# EAGLE design Display (EAGLE 9.2.2)
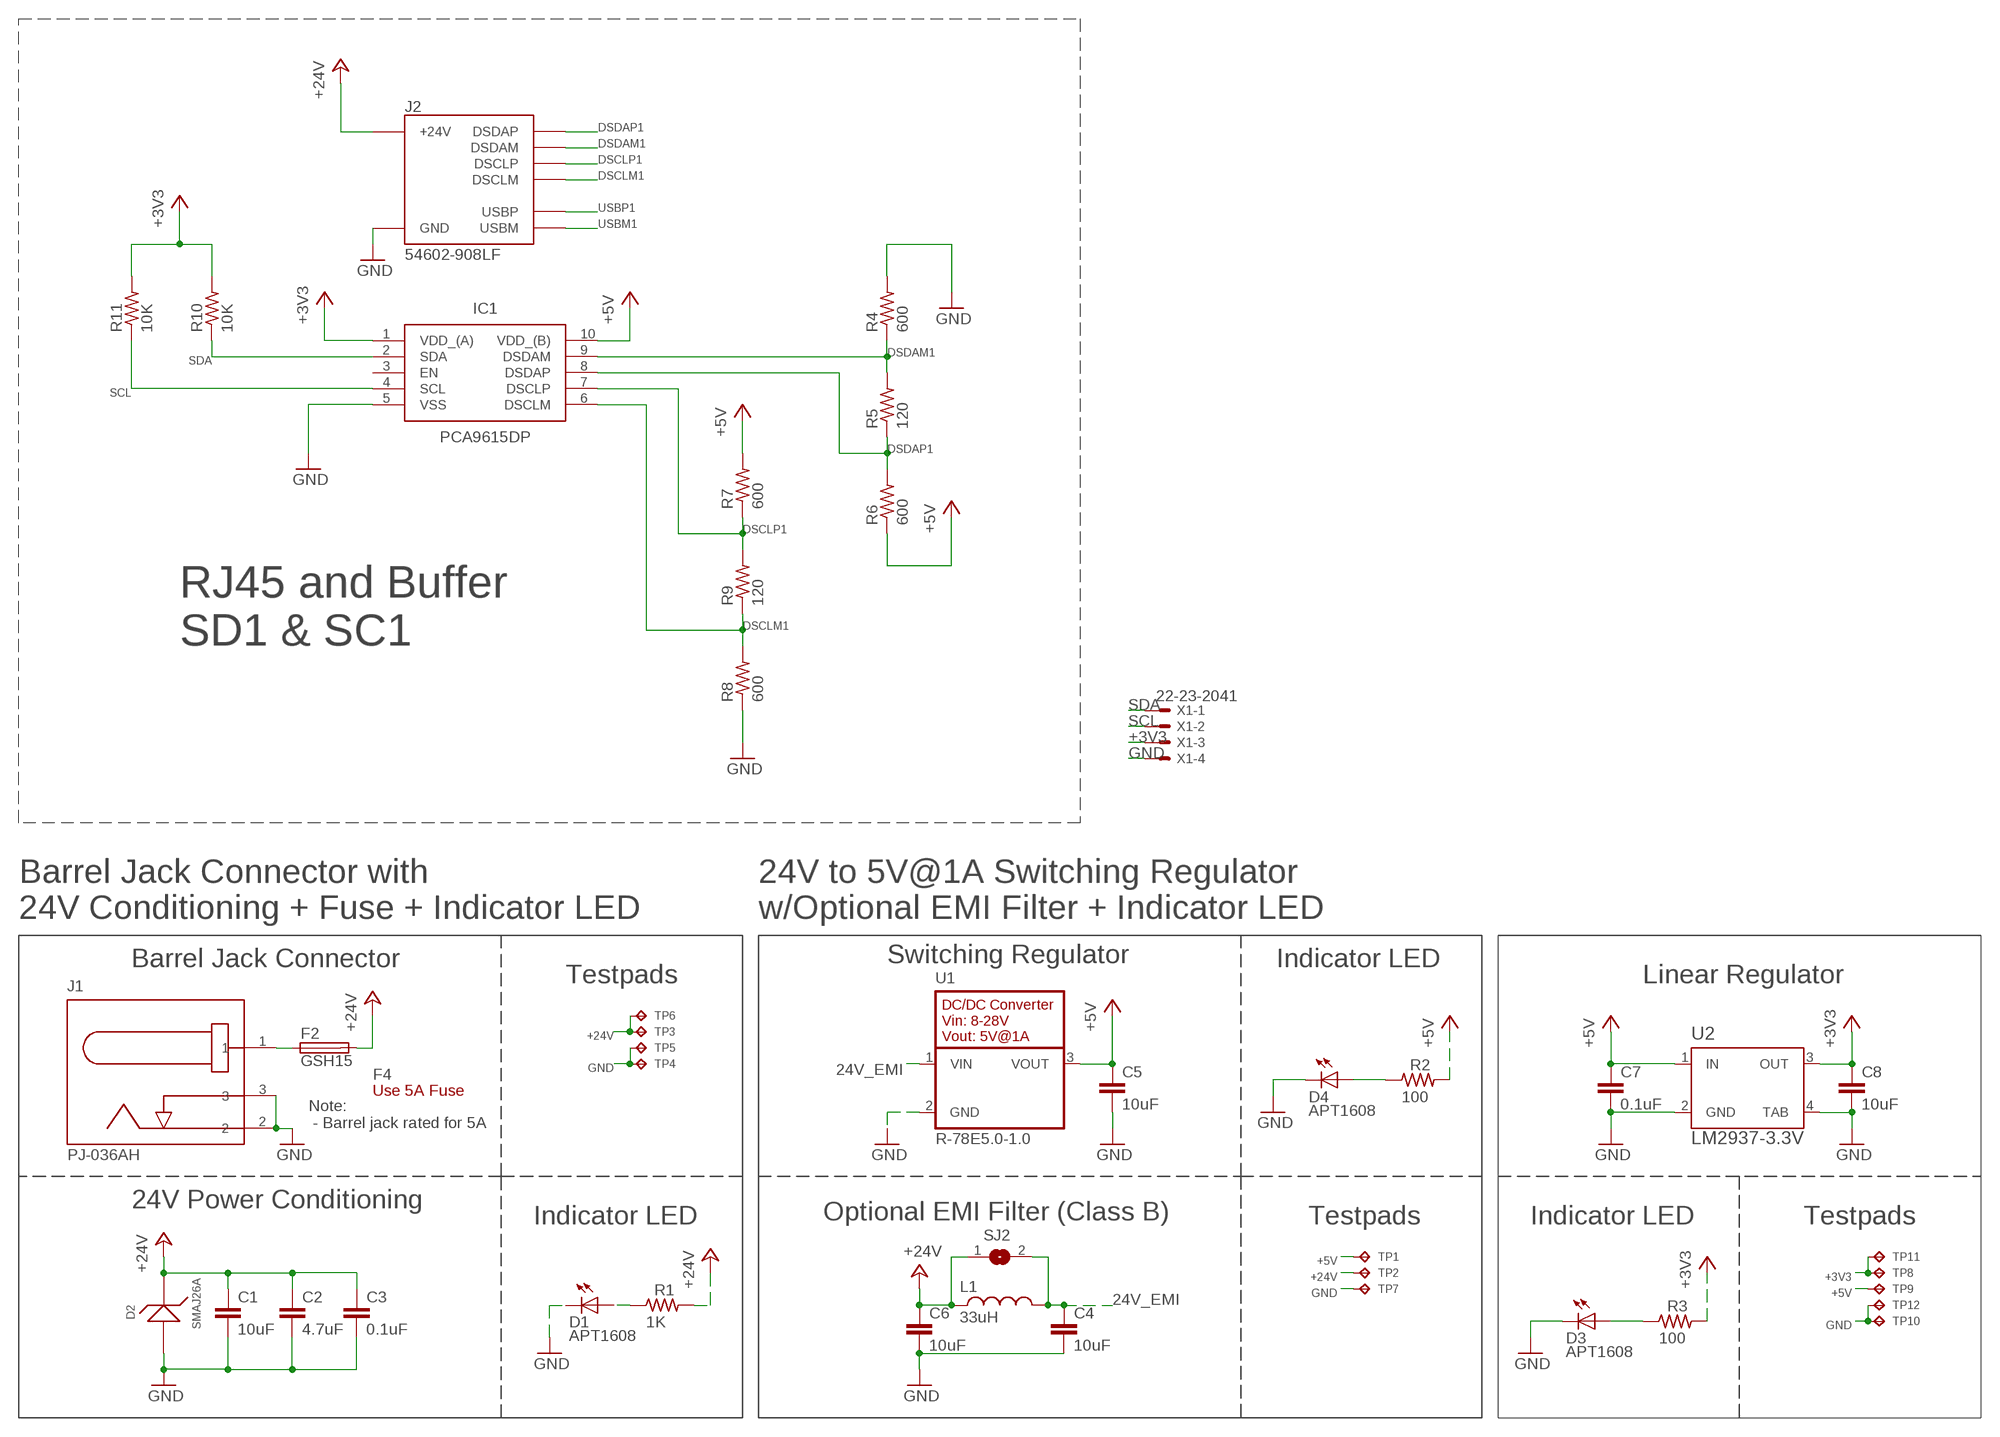
[diagram p0: schematic, sheet 1]

## Parts
C1  10uF  10UF-GMK212BBJ106KG-T  [C0805]
C2  4.7uF  4.7UF-CL21A475KBQNNNE  [C0805]
C3  0.1uF  0.1UF-C0603C104K5RACTU  [C0603]
C4  10uF  10UF-GMK212BBJ106KG-T  [C0805]
C5  10uF  10UF-GMK212BBJ106KG-T  [C0805]
C6  10uF  10UF-GMK212BBJ106KG-T  [C0805]
C7  0.1uF  0.1UF-C0603C104K5RACTU  [C0603]
C8  10uF  10UF-GMK212BBJ106KG-T  [C0805]
D1  APT1608  APT1608CGCK  [CHIPLED_0603]
D2  SMAJ26A  SMAJ26A-13-F  [SMA]
D3  APT1608  APT1608CGCK  [CHIPLED_0603]
D4  APT1608  APT1608CGCK  [CHIPLED_0603]
F2  GSH15  [GSH15]
F4  Use 5A Fuse  0217005.MXP  [FUSE-CARTRIDGE]
IC1  PCA9615DP  [SOP50P490X110-10N]
J1  PJ-036AH  BARREL-JACK-PJ-036AH-SMT-TR  [BARREL-JACK-PJ-036AH]
J2  54602-908LF  OPENAG-V1-RJ45PTH  [OPENAG-V1-RJ45]
L1  33uH  33UH-29333C  [29333C]
R1  1K  1K-ERJ-PB3D1001V  [RC0603N]
R2  100  100OHM-RC0603JR-07100RL  [RC0603N]
R3  100  100OHM-RC0603JR-07100RL  [RC0603N]
R4  600  R-US_R0603  [R0603]
R5  120  R-US_R0603  [R0603]
R6  600  R-US_R0603  [R0603]
R7  600  R-US_R0603  [R0603]
R8  600  R-US_R0603  [R0603]
R9  120  R-US_R0603  [R0603]
R10  10K  R-US_R0603  [R0603]
R11  10K  R-US_R0603  [R0603]
SJ2  EMI-BYPASS  [EMI-BYPASS]
TP1  TPTP06R  [TP06R]
TP2  TPTP06R  [TP06R]
TP3  TPTP04R  [TP04R]
TP4  TPTP04R  [TP04R]
TP5  TPTP04R  [TP04R]
TP6  TPTP04R  [TP04R]
TP7  TPTP06R  [TP06R]
TP8  TPTP04R  [TP04R]
TP9  TPTP04R  [TP04R]
TP10  TPTP04R  [TP04R]
TP11  TPTP04R  [TP04R]
TP12  TPTP04R  [TP04R]
U1  R-78E5.0-1.0  [R-78E5.0-1.0]
U2  LM2937-3.3V  LM2937IMP-3.3/NOPB  [MP04A]
X1  22-23-2041  [22-23-2041]

## Nets
24V_EMI: C4.1 L1.2 SJ2.2 U1.1(VIN)
24V_IN1: F2.1 J1.1
+3V3: C8.1 IC1.1(VDD_(A)) R3.2 R10.2 R11.2 TP8.1(TP) TP11.1(TP) U2.3(OUT) X1.3
+5V: C5.1 C7.1 IC1.10(VDD_(B)) R2.2 R6.1 R7.2 TP1.TP TP9.1(TP) U1.3(VOUT) U2.1(IN)
+24V: C1.1 C2.1 C3.1 C6.1 D2.1 F2.2 J2.24V(6)(+24V) L1.1 R1.2 SJ2.1 TP2.TP TP3.1(TP) TP6.1(TP)
DSCLM1: IC1.6(DSCLM) J2.DSCLM(5)(DSCLM) R8.2 R9.1
DSCLP1: IC1.7(DSCLP) J2.DSCLP(4)(DSCLP) R7.1 R9.2
DSDAM1: IC1.9(DSDAM) J2.DSDAM(2)(DSDAM) R4.1 R5.2
DSDAP1: IC1.8(DSDAP) J2.DSDAP(1)(DSDAP) R5.1 R6.2
GND: C1.2 C2.2 C3.2 C4.2 C5.2 C6.2 C7.2 C8.2 D1.C D2.2 D3.C D4.C IC1.5(VSS) J1.2 J1.3 J2.GND(3)(GND) R4.2 R8.1 TP4.1(TP) TP5.1(TP) TP7.TP TP10.1(TP) TP12.1(TP) U1.2(GND) U2.2(GND) U2.4(TAB) X1.4
N$1: D1.A R1.1
N$3: D4.A R2.1
N$4: D3.A R3.1
SCL: IC1.4(SCL) R11.1 X1.2
SDA: IC1.2(SDA) R10.1 X1.1
USBM1: J2.USBM(8)(USBM)
USBP1: J2.USBP(7)(USBP)
Unconnected: IC1.3(EN)

## Notes on the sheet
- RJ45 and Buffer
  SD1 & SC1
- Barrel Jack Connector with
  24V Conditioning + Fuse + Indicator LED
- 24V to 5V@1A Switching Regulator
  w/Optional EMI Filter + Indicator LED
- Barrel Jack Connector | Switching Regulator | Indicator LED
- Testpads | Linear Regulator
- Note:
   - Barrel jack rated for 5A
- 24V Power Conditioning
- Indicator LED | Optional EMI Filter (Class B) | Testpads | Indicator LED | Testpads

## Library data of the parts
C1 C4-C6 C8 = openag-capacitors:10UF-GMK212BBJ106KG-T: CAP CER 10UF 35V X5R 0805 Description: 10µF ±10% 35V Ceramic Capacitor X5R 0805 (2012 Metric) Technical Specifications: Capacitance: 10µF Tolerance: ±10% Rated Voltage: 35V Temperature Coefficient: X5R Operating Temperature: -55°C ~ 85°C Package / Case: 0805 (2012 Metric) Datasheet(s): GMK212BBJ106KG-T Spec <http://ds.yuden.co.jp/TYCOMPAS/ut/detail.do?productNo=GMK212BBJ106KG-T&fileName=GMK212BBJ106KG-T_SS&mode=specSheetDownload> Vendor(s): Digikey: 587-4893-1-ND <https://www.digikey.com/product-detail/en/taiyo-yuden/GMK212BBJ106KG-T/587-4893-1-ND/6563736>; MANUFACTURER: Taiyo Yuden; MPN: GMK212BBJ106KG-T; VENDOR: Digikey; VLINK: https://www.digikey.com/product-detail/en/taiyo-yuden/GMK212BBJ106KG-T/587-4893-1-ND/6563736; VPN: 587-4893-1-ND
C2 = openag-capacitors:4.7UF-CL21A475KBQNNNE: CAP CER 4.7UF 50V X5R 0805 Description: 4.7µF ±10% 50V Ceramic Capacitor X5R 0805 (2012 Metric) Technical Specifications: Capacitance: 4.7uF Tolerance: ±10% Rated Voltage: 50V Temperature Coefficient: X5R Operating Temperature: -55°C ~ 85°C Package/Case: 0805 (2012 Metric) Datasheet(s): CL21A475KBQNNNE Characteristics <http://www.samsungsem.com/kr/front/downloadcms.do?path=/kr/support/product-search/mlcc/__icsFiles/afieldfile/2014/11/05&fileName=C_CL21A475KBQNNNE.pdf> Vendor(s): Digikey: 1276-1248-1-ND <https://www.digikey.com/product-detail/en/samsung-electro-mechanics/CL21A475KBQNNNE/1276-1248-1-ND/3889334>; MANUFACTURER: Samsung; MPN: CL21A475KBQNNNE; VENDOR: Digikey; VLINK: https://www.digikey.com/product-detail/en/samsung-electro-mechanics/CL21A475KBQNNNE/1276-1248-1-ND/3889334; VPN: 1276-1248-1-ND
C3 C7 = openag-capacitors:0.1UF-C0603C104K5RACTU: CAP CER 0.1UF 50V X7R 0603 Description: 0.1µF ±10% 50V Ceramic Capacitor X7R 0603 (1608 Metric) Technical Specifications: Capacitance: 0.1µF Tolerance: ±10% Rated Voltage: 50V Temperature Coefficient: X7R Operating Temperature: -55°C ~ 125°C Package / Case: 0603 (1608 Metric) Datasheet(s): X7R Dielectric, 6.3-250 VDC <https://search.kemet.com/component-edge/download/datasheet/C0603C104K5RACTU.pdf> Vendor(s): Digikey: 399-5089-1-ND <https://www.digikey.com/product-detail/en/kemet/C0603C104K5RACTU/399-5089-1-ND/1465623>; MANUFACTURER: Kemet; MPN: C0603C104K5RACTU; VENDOR: Digikey; VLINK: https://www.digikey.com/product-detail/en/kemet/C0603C104K5RACTU/399-5089-1-ND/1465623; VPN: 399-5089-1-ND
D1 D3 D4 = openag-diodes:APT1608CGCK: LED GREEN CLEAR 0603 SMD Description: Green 570nm LED Indication - Discrete 2.1V 0603 (1608 Metric) Technical Specifications: Color: Green Lens Color: Colorless Lens Transparency: Clear Millicandela Rating: 50mcd Lens Style/Size: Rectangle with Flat Top, 1.20mm x 0.80mm Voltage - Forward (Vf) (Typ): 2.1V Current - Test: 20mA Viewing Angle: 120° Mounting Type: Surface Mount Wavelength - Dominant: 570nm Wavelength - Peak: 574nm Package / Case: 0603 (1608 Metric) Supplier Device Package: Chip LED Size / Dimension: 1.60mm L x 0.80mm W Height (Max): 0.75mm Datasheet(s): APT1608CGCK <http://www.kingbrightusa.com/images/catalog/SPEC/APT1608CGCK.pdf> Vendor(s): Digikey: 754-1116-1-ND <https://www.digikey.com/product-detail/en/kingbright/APT1608CGCK/754-1116-1-ND/1747833#>; MANUFACTURER: Kingbright; MPN: APT1608CGCK; VENDOR: Digikey; VLINK: https://www.digikey.com/product-detail/en/kingbright/APT1608CGCK/754-1116-1-ND/1747833#; VPN: 754-1116-1-ND
D2 = openag-diodes:SMAJ26A-13-F: TVS DIODE 26VWM 42.1VC SMA Description: TVS DIODE 26VWM 42.1VC SMA Technical Specifications: Type: Zener Voltage - Reverse Standoff (Typ): 26V Voltage - Breakdown (Min): 28.9V Voltage - Clamping (Max) @ Ipp: 42.1V Current - Peak Pulse (10/1000µs): 9.5A Power - Peak Pulse: 400W Power Line Protection: No Operating Temperature: -55°C ~ 150°C (TJ) DO-214AC, SMA Datasheet(s): SMAJ5.0(C)A - SMAJ200(C)A Vendor(s): Digikey: SMAJ26A-FDICT-ND <https://www.digikey.com/product-detail/en/diodes-incorporated/SMAJ26A-13-F/SMAJ26A-FDICT-ND/806583>; MANUFACTURER: Diodes Incorporated; MPN: SMAJ26A-13-F; VENDOR: Digikey; VLINK: https://www.digikey.com/product-detail/en/diodes-incorporated/SMAJ26A-13-F/SMAJ26A-FDICT-ND/806583; VPN: SMAJ26A-FDICT-ND
F2 = openag-fuses:GSH15: FUSE BLOCK CART 250V 6.3A PCB Description: Fuse Block 6.3A 250V 1 Circuit Cartridge PCB Technical Specifications: Fuseholder Type: Block Fuse Type: Cartridge For Use With/Related Products: 5mm x 20mm Fuse Size: 5mm x 20mm Number of Circuits: 1 Voltage: 250V Current Rating: 6.3A Mounting Type: PCB Orientation: Horizontal Termination Style: PC Pin Contact Material: Copper Alloy Contact Finish: Tin Datasheet(s): 649 Series <http://www.littelfuse.com/~/media/electronics/datasheets/fuse_blocks/littelfuse_fuse_block_649_datasheet.pdf.pdf> Vendor(s): Digikey: WK0011-ND <https://www.digikey.com/product-detail/en/littelfuse-inc/64900001039/WK0011-ND/245470>; MANUFACTURER: Littelfuse Inc.; MPN: 64900001039; VENDOR: Digikey; VLINK: https://www.digikey.com/product-detail/en/littelfuse-inc/64900001039/WK0011-ND/245470; VPN: WK0011-ND
F4 = openag-fuses:0217005.MXP: FUSE GLASS 5A 250VAC 5X20MM Description: FUSE GLASS 5A 250VAC 5X20MM Technical Specifications: Fuse Type: Cartridge, Glass Current Rating: 5A Voltage Rating - AC: 250V Response Time: Fast Package / Case: 5mm x 20mm Mounting Type: Holder Breaking Capacity @ Rated Voltage: 50A Melting I²t: 42.795 Approvals: BSI, CE, CCC, CSA, KC, PSE, SEMKO, UR, VDE Operating Temperature: -55°C ~ 125°C Size / Dimension: 0.205" Dia x 0.787" L (5.20mm x 20.00mm) DC Cold Resistance: 0.0137 Ohms Datasheet(s): 217 Series Datasheet <http://www.littelfuse.com/~/media/electronics/datasheets/fuses/littelfuse_fuse_217_datasheet.pdf.pdf> Vendor(s): Digikey: F1725-ND <https://www.digikey.com/product-detail/en/littelfuse-inc/0217005.MXP/F1725-ND/777549#>; MANUFACTURER: Littelfuse Inc.; MPN: 0217005.MXP; VENDOR: Digikey; VLINK: https://www.digikey.com/product-detail/en/littelfuse-inc/0217005.MXP/F1725-ND/777549; VPN: F1725-ND
IC1 = PCA9615DP:PCA9615DP: Buffer, ReDriver 2 Channel 400kHz 10-TSSOP Source: Datasheet <http://www.nxp.com/docs/en/data-sheet/PCA9615.pdf>; DESCRIPTION: Buffer, ReDriver 2 Channel 400kHz 10-TSSOP; HEIGHT: 1.1mm; MANUFACTURER_NAME: Nexperia; MANUFACTURER_PART_NUMBER: PCA9615DP; SUPPLIER_NAME: RS
J1 = openag-connectors:BARREL-JACK-PJ-036AH-SMT-TR: CONN PWR JACK 2X5.5MM SOLDER Description: Power Barrel Connector Jack 2.10mm ID (0.083"), 5.50mm OD (0.217") Surface Mount, Right Angle Technical Specifications: Connector Type: Jack Gender: Male Industry Recognized Mating Diameter: 2.10mm ID (0.083"), 5.50mm OD (0.217") Actual Diameter: 0.078" (2.00mm ID), 0.248" (6.30mm OD) Number of Positions/Contacts: 2 Conductors, 3 Contacts Internal Switch(s): Single Switch, Normally Closed Mounting Type: Surface Mount, Right Angle Termination: Solder Shielding: Unshielded Voltage - Rated: 24VDC Current Rating: 5A Mating Length/Depth: 0.360" (9.15mm) Contact Material - Plating: Silver Operating Temperature: -25°C ~ 85°C Housing Material: Polyamide (PA6T), Nylon 6T Contact Material: Brass; Copper Alloy Body Color: Black Datasheet(s): PJ-036AH-SMT-TR <http://www.cui.com/product/resource/digikeypdf/pj-036ah-smt-tr.pdf> Vendor(s): Digikey: CP-036AHPJCT-ND <https://www.digikey.com/product-detail/en/cui-inc/PJ-036AH-SMT-TR/CP-036AHPJCT-ND/1530994>; MANUFACTURER: CUI Inc.; MPN: PJ-036AH-SMT-TR; VENDOR: Digikey; VLINK: https://www.digikey.com/product-detail/en/cui-inc/PJ-036AH-SMT-TR/CP-036AHPJCT-ND/1530994; VPN: CP-036AHPJCT-ND
J2 = openag_connector:OPENAG-V1-RJ45: Amphenol FCI - 54602-908LF - CONN MOD JACK 8P8C R/A UNSHLD Description: Jack Modular Connector 8p8c (RJ45, Ethernet) 90� Angle (Right) Unshielded Cat3 Technical Specifications: Connector Type: Jack Number of Positions/Contacts: 8p8c (RJ45, Ethernet) Number of Ports: 1 Number of Rows: 1 Mounting Type: Through Hole Orientation: 90� Angle (Right) Termination: Solder Shielding: Unshielded Ratings: Cat3 Features: Board Lock LED Color: Does Not Contain LED Tab Direction: Down Contact Material: Copper Alloy Contact Finish: Gold Contact Finish Thickness: 15�in (0.38�m) Housing Material: Polyester, Glass Filled Operating Temperature: -40�C ~ 70�C Datasheet(s): 54601-x04(zzz)WPLF Drawing <http://cdn.amphenol-icc.com/media/wysiwyg/files/drawing/c-bmj-0102.pdf> Vendor(s): Digikey: 609-1046-ND <https://www.digikey.com/product-detail/en/amphenol-fci/54602-908LF/609-1046-ND/1001360>; POPULATE: YES; VERIFIED: NO
L1 = openag-inductors:33UH-29333C: FIXED IND 33UH 1A 120 MOHM SMD Description: 33µH Shielded Wirewound Inductor 1A 120 mOhm Max Nonstandard Technical Specifications: Type: Wirewound Inductance: 33µH Current Rating: 1A Shielding: Shielded DC Resistance (DCR): 120 mOhm Max Operating Temperature: -40°C ~ 85°C Frequency - Test: 10kHz Mounting Type: Surface Mount Package / Case: Nonstandard Size / Dimension: 0.283" L x 0.283" W (7.20mm x 7.20mm) Height - Seated (Max): 0.157" (4.00mm) Datasheet(s): 2900 Series <https://www.murata-ps.com/data/magnetics/kmp_2900.pdf> Vendor(s): Digikey: 811-1138-1-ND <https://www.digikey.com/product-detail/en/murata-power-solutions-inc/29333C/811-1138-1-ND/1924860>; MANUFACTURER: Murata Power Solutions Inc.; MPN: 29333C; VENDOR: Digikey; VLINK: https://www.digikey.com/product-detail/en/murata-power-solutions-inc/29333C/811-1138-1-ND/1924860; VPN: 811-1138-1-ND
R1 = openag-resistors:1K-ERJ-PB3D1001V: RES SMD 1K OHM 0.5% 1/5W 0603 Description: 1 kOhms ±0.5% 0.2W, 1/5W Chip Resistor 0603 (1608 Metric) Automotive AEC-Q200, Pulse Withstanding Thick Film Technical Specifications: Resistance: 1 kOhms Tolerance: ±0.5% Power: 0.2W, 1/5W Operating Temperature: -55°C ~ 155°C Package / Case: 0603 (1608 Metric) Datasheet(s): ERJ-PB3, PB6 Series, High Precision Datasheet <https://industrial.panasonic.com/cdbs/www-data/pdf/RDM0000/AOA0000C328.pdf> Vendor(s): Digikey: P20283CT-ND <https://www.digikey.com/product-detail/en/panasonic-electronic-components/ERJ-PB3D1001V/P20283CT-ND/6214538>; MANUFACTURER: Panasonic; MPN: P20283CT-ND; VENDOR: Digikey; VLINK: https://www.digikey.com/product-detail/en/panasonic-electronic-components/ERJ-PB3D1001V/P20283CT-ND/6214538; VPN: P20283CT-ND
R2 R3 = openag-resistors:100OHM-RC0603JR-07100RL: RES SMD 100 OHM 5% 1/10W 0603 Description: 100 Ohms ±5% 0.1W, 1/10W Chip Resistor 0603 (1608 Metric) Moisture Resistant Thick Film Technical Specifications: Resistance: 100 Ohms Tolerance: ±5% Power (Watts): 0.1W, 1/10W Composition: Thick Film Features: Moisture Resistant Temperature Coefficient: ±100ppm/°C Operating Temperature: -55°C ~ 155°C Package / Case: 0603 (1608 Metric) Supplier Device Package: 0603 Size / Dimension: 0.063" L x 0.032" W (1.60mm x 0.80mm) Height - Seated (Max): 0.022" (0.55mm) Number of Terminations: 2 Datasheet(s): Thick Film Chip Resistor Intro <http://www.yageo.com.tw/exep/pages/download/literatures/PYu-R_INT-thick_7.pdf> Chip Resistor Marking <http://www.yageo.com/exep/pages/download/literatures/PYu-R_Marking_2.pdf> RC Series, L Datasheet <http://www.yageo.com/documents/recent/PYu-RC_Group_51_RoHS_L_8.pdf> Vendor(s): Digikey: 311-100GRCT-ND <https://www.digikey.com/product-detail/en/yageo/RC0603JR-07100RL/311-100GRCT-ND/729644>; MANUFACTURER: Yageo; MPN: RC0603JR-07100RL; VENDOR: Digikey; VLINK: https://www.digikey.com/product-detail/en/yageo/RC0603JR-07100RL/311-100GRCT-ND/729644; VPN: 311-100GRCT-ND
R4-R11 = rcl:R-US_: RESISTOR, American symbol
SJ2 = openag-connectors:EMI-BYPASS: EMI Bypass Solder Jumper; MPN: N/A
TP1-TP12 = openag-testpads:TP: Test pad; MPN: N/A
U1 = openag-regulators:R-78E5.0-1.0: DC/DC CONVERTER 5V 5W Description: Linear Regulator Replacement DC DC Converter 1 Output 5V 1A 8V - 28V Input Technical Specifications: Type: Linear Regulator Replacement Number of Outputs: 1 Voltage - Input (Min): 8V Voltage - Input (Max): 28V Voltage - Output 1: 5V Current - Output (Max): 1A Power (Watts): 5W Applications: ITE (Commercial) Features: SCP Operating Temperature: -40°C ~ 85°C Efficiency: 91% Mounting Type: Through Hole Package / Case: 3-SIP Module Size / Dimension: 0.46" L x 0.33" W x 0.41" H (11.6mm x 8.5mm x 10.4mm) Datasheet(s): R-78E-1.0 Series Datasheet <https://www.recom-power.com/pdf/Innoline/R-78Exx-1.0.pdf> Vendor(s): Digikey: 945-2201-ND <https://www.digikey.com/product-detail/en/recom-power/R-78E5.0-1.0/945-2201-ND/4930585>; MANUFACTURER: Recom Power; MPN: R-78E5.0-1.0; VENDOR: Digikey; VLINK: https://www.digikey.com/product-detail/en/recom-power/R-78E5.0-1.0/945-2201-ND/4930585; VPN: 945-2201-ND
U2 = openag-regulators:LM2937IMP-3.3/NOPB: IC REG LIN 3.3V 400MA SOT223-4 Description: Linear Voltage Regulator IC Positive Fixed 1 Output 3.3V 400mA SOT-223-4 Technical Specifications: Output Configuration: Positive Output Type: Fixed Number of Regulators: 1 Voltage - Input (Max): 26V Voltage - Output (Min/Fixed): 3.3V Voltage Dropout (Max): 1V @ 50mA Current - Output: 400mA Current - Quiescent (Iq): 2mA Current - Supply (Max): 1.25A Protection Features: Over Temperature, Reverse Polarity, Short Circuit Operating Temperature: -40°C ~ 85°C Mounting Type: Surface Mount Package / Case: TO-261-4, TO-261AA Supplier Device Package: SOT-223-4 Base Part Number: LM2937 Datasheet(s): LM2937-2.5, LM2937-3.3 Datasheet <http://www.ti.com/lit/ds/symlink/lm2937-2.5.pdf> Vendor(s): Digikey: LM2937IMP-3.3/NOPBCT-ND <https://www.digikey.com/product-detail/en/texas-instruments/LM2937IMP-3.3-NOPB/LM2937IMP-3.3-NOPBCT-ND/270742#>; MANUFACTURER: Texas Instruments; MPN: LM2937IMP-3.3/NOPB; VENDOR: Digikey; VLINK: https://www.digikey.com/product-detail/en/texas-instruments/LM2937IMP-3.3-NOPB/LM2937IMP-3.3-NOPBCT-ND/270742#; VPN: LM2937IMP-3.3/NOPBCT-ND
X1 = con-molex:22-23-2041: .100" (2.54mm) Center Header - 4 Pin; MF: MOLEX; MPN: 22-23-2041; OC_FARNELL: 1462920; OC_NEWARK: 38C0355

## Board
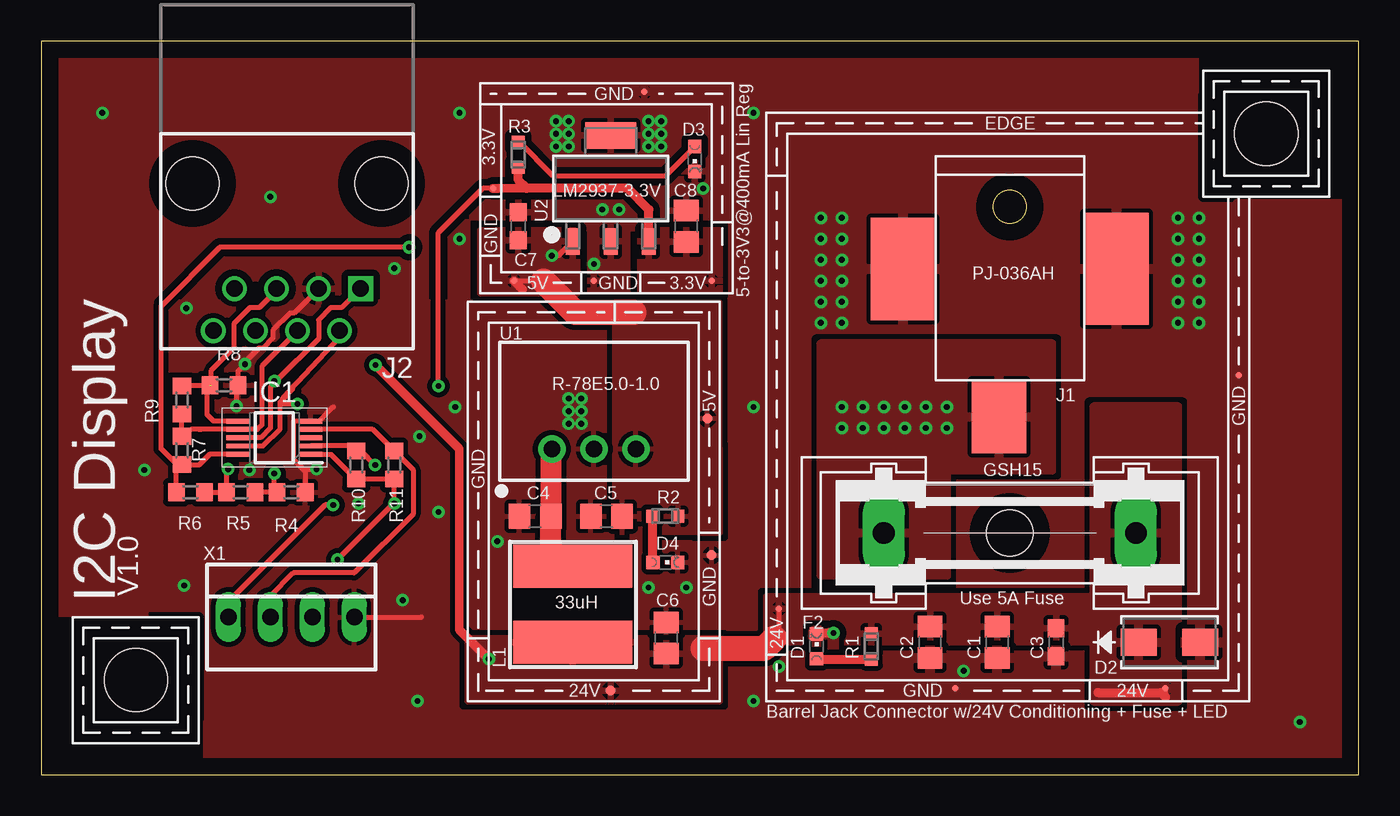
[diagram p1: board, top side]
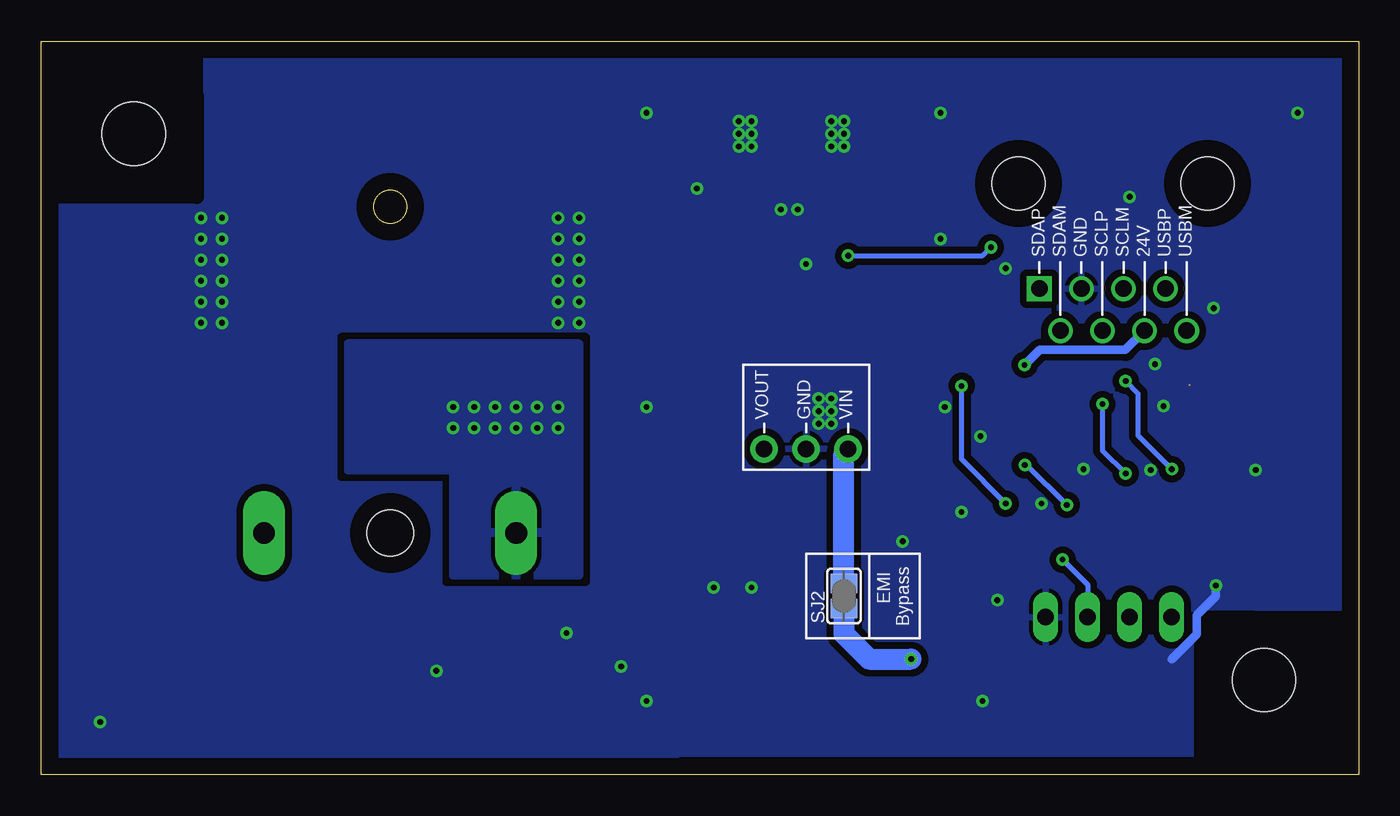
[diagram p2: board, bottom side, seen from below]

Size 79.63 x 44.32 mm. Coordinates in mm from the lower left corner, seen from the top.
Outline: 0,0 79.63,0 79.63,44.32 0,44.32 0,0
Copper layers (1*16): Top 0.035mm / dielectric 1.5mm / Bottom 0.035mm
Design rules "default": minimum track width 6mil, minimum drill 0.35mm, track to track 6mil, track to pad 6mil, pad to pad 6mil, via to via 6mil, smd to smd 6mil, copper to edge 40mil, drill to drill 6mil, minimum pad ring 10mil, minimum via ring 8mil, stop-mask expansion 4mil, vias tented up to drill 0mil, thermal gap 10mil
tRestrict: 2 lines

### Footprints (pad centres in the part's own frame; a part is rotated, then mirrored left to right if it is on the bottom)
C0805 = smd 1.3 x 1.5: 1 -0.95,0; 2 0.95,0
C0603 = smd 1.1 x 1: 1 -0.85,0; 2 0.85,0
CHIPLED_0603 = smd 0.8 x 0.8: A 0,-0.75; C 0,0.75
SMA = smd 2.18 x 1.63: 1 -1.857,0; 2 1.857,0
GSH15 = drill 1.321 pad 2.54 long: 1 -7.62,0; 2 7.62,0 | hole 2.794: 0,0
SOP50P490X110-10N = smd 1.4 x 0.3: 1 -2.2,1; 2 -2.2,0.5; 3 -2.2,0; 4 -2.2,-0.5; 5 -2.2,-1; 6 2.2,-1; 7 2.2,-0.5; 8 2.2,0; 9 2.2,0.5; 10 2.2,1
BARREL-JACK-PJ-036AH = smd 4.4 x 3.3: 1 2.2,-0.65 | smd 6.75 x 3.9: 2 -6.75,6.45 | smd 6.2 x 3.9: 3 -6.75,-6.45
OPENAG-V1-RJ45 = drill 1: 24V(6) 1.905,8.89; DSCLM(5) 0.635,6.35; DSCLP(4) -0.635,8.89; DSDAM(2) -3.175,8.89; GND(3) -1.905,6.35; USBM(8) 4.445,8.89; USBP(7) 3.175,6.35 | drill 1 square: DSDAP(1) -4.445,6.35 | hole 3.2: -5.715,0; 5.715,0
29333C = smd 2.6 x 7.2: 1 -2.3,0; 2 2.3,0
RC0603N = smd 0.756 x 0.8: 1 -0.778,0; 2 0.778,0
R0603 = smd 1 x 1.1: 1 -0.85,0; 2 0.85,0
EMI-BYPASS = smd 1.168 x 1.6: 1 -0.762,0.254; 2 0.762,0.254
TP06R = smd 0.6 x 0.6: TP 0,0
TP04R = smd 0.4 x 0.4: 1 0,0
R-78E5.0-1.0 = drill 1 pad 1.676: 1 -2.54,0; 2 0,0; 3 2.54,0
MP04A = smd 1.6 x 0.838: 1 -3.2,2.3; 2 -3.2,0; 3 -3.2,-2.3 | smd 1.6 x 3.099: 4 3.2,0
CORNER = hole 3.81: 0,0
22-23-2041 = drill 1 long: 1 -3.81,0; 2 -1.27,0; 3 1.27,0; 4 3.81,0

### Placement (x,y rotation side)
C1  57.78,8 270 top
C2  53.72,8 270 top
C3  61.34,8 270 top
C4  29.84,15.62 180 top
C5  34.16,15.62 180 top
C6  37.78,8.26 90 top
C7  28.83,33.15 90 top
C8  38.99,33.15 90 top
D1  46.86,7.75 0 top
D2  68.2,8 0 top
D3  39.5,37.21 180 top
D4  37.72,12.83 270 top
F2  58.55,14.6 0 top
F4  55.5,10.29 0 top
IC1  14.09,20.36 180 top
J1  58.55,23.83 270 top
J2  14.85,35.73 180 top
L1  32.13,10.29 90 top
R1  50.17,7.75 90 top
R2  37.72,15.62 0 top
R3  28.83,37.46 270 top
R4  15.1,17.06 0 top
R5  12.05,17.06 0 top
R6  9.01,17.06 0 top
R7  8.5,19.6 270 top
R8  11.04,23.54 180 top
R9  8.5,22.65 270 top
R10  19.04,18.71 270 top
R11  21.33,18.71 270 top
SJ2  30.86,10.8 90 bottom
TP1  40.26,21.53 0 top
TP2  34.42,5.08 0 top
TP3  67.95,5.21 0 top
TP4  55.24,5.21 0 top
TP5  72.39,24.13 0 top
TP6  44.58,10.03 0 top
TP7  40.51,13.27 0 top
TP8  27.3,35.43 0 top
TP9  28.57,29.85 0 top
TP10  36.45,41.27 0 top
TP11  40.51,29.85 0 top
TP12  33.4,29.85 0 top
U1  33.4,19.69 0 top
U2  34.42,35.43 90 top
U$1  [CORNER]  74.04,38.74 180 top
U$2  [CORNER]  5.71,5.72 0 top
X1  15.11,9.52 0 top

### Tracks (layer width: path | path; a pad name or v marks a point on that pad's centre or on a via)
24V_EMI
  Top 1.27: U1.1 30.8,19.62 C4.1 30.8,13.92 arc90 L1.2
  Bottom 1.27: SJ2.2 31.11,19.43 U1.1
24V_IN1  (via drill 0.35)
  other vias: 54.74,22.23 54.74,20.96 53.47,22.23 53.47,20.96 52.2,22.23 52.2,20.96 50.93,22.23 49.66,22.23 49.66,20.96 50.93,20.96 48.39,20.96 48.39,22.23
  pour Bottom (isolate 0.406): 54.74,12.07 47.12,12.07 47.12,26.04 61.09,26.04 61.09,18.41 54.74,18.41
  pour Top (isolate 0.406): 47.12,12.07 54.74,12.07 54.74,18.41 61.09,18.41 61.09,26.04 47.12,26.04
+3V3  (via drill 0.35)
  Top 0.305: IC1.1 17.5,19.36 19,17.86 R10.2 R11.2 21.34,17.85 v21.34,16.38 21.28,16.38 v17.9,13 | v24,23.49 24,32.77 26.67,35.43 TP8.1
  Top 0.508: 27.57,35.43 29.34,35.43
  Top 0.559: R3.2 28.83,35.94 29.34,35.43 35.43,35.43 36.72,34.15 U2.3 | TP8.1 27.57,35.43
  Bottom 0.305: v21.34,16.38 24,19.05 v24,23.49 | v17.9,13 16.38,11.48 X1.3
  pour Top (isolate 0.305): 41.02,29.21 41.02,32.89 36.19,32.89 36.19,29.21
+5V  (via drill 0.35)
  Top 0.305: U2.1 31.25,31.37 v30.86,31.37 | TP9.1 30.35,29.85 | IC1.10 10.17,19.36 9.52,18.71 8.54,18.71 | 8.54,18.71 R7.2 8.17,18.75 7.24,19.69 7.24,28.32 10.8,31.88 v22.22,31.88 | 8.54,18.71 8.16,18.33 R6.1 8.03,17.19
  Top 0.559: TP9.1 29.08,29.34
  Top 1.524: 30.35,29.85 32.26,27.94 35.81,27.94
  Bottom 0.305: v30.86,31.37 22.73,31.37 v22.22,31.88
  pour Top (isolate 0.305): 41.02,28.57 41.02,14.6 34.67,14.6 34.67,28.57
  pour Top (isolate 0.406): 39.75,14.6 41.02,14.6 41.02,19.69 39.75,19.69
  pour Top (isolate 0.305): 26.54,29.08 32.38,29.08 32.38,32.89 26.54,32.89
  pour Top (isolate 0.406): 31.62,29.08 31.62,30.35 26.54,30.35 26.54,29.08
+24V  (via drill 0.35)
  Top 0.305: TP3.1 67.95,4.7 | TP6.1 44.58,8.51 44.32,8.26
  Top 0.508: v27.05,6.98 25.27,8.76 25.27,19.69 v20.19,24.77
  Top 0.559: 63.88,4.95 67.69,4.95 67.95,4.7
  Top 1.524: 44.32,8.26 43.69,7.62 40,7.62
  Bottom 0.508: J2.24V(6) 14.1,25.68 19.28,25.68 v20.19,24.77
  Bottom 1.27: SJ2.1 31.11,8.51 29.59,6.98 v27.05,6.98
  pour Top (isolate 0.406): 68.71,4.45 68.71,22.23 63.63,22.23 63.63,4.45
  pour Top (isolate 0.406): 64.14,10.8 64.14,8 43.81,8 43.81,10.8
  pour Top (isolate 0.406): 41.02,8.26 41.02,4.45 25.78,4.45 25.78,8.26
DSCLM1  (1 unrouted)
  Top 0.305: R9.1 8.54,23.54 10.02,23.54 | 10.02,23.54 R8.2 | IC1.6 10.42,21.36 10.02,21.76 10.02,23.54 | 10.28,23.54 10.28,24.43 11.67,25.82 11.67,27.3 12.62,28.24 13.2,28.24 14.21,29.25 J2.DSCLM(5)
DSCLP1
  Top 0.305: R9.2 R7.1 9.05,20.87 9.52,20.87 9.65,20.86 IC1.7 13.06,20.86 13.32,21.13 13.32,24.68 J2.DSCLP(4)
DSDAM1  (via drill 0.35)
  Top 0.305: J2.DSDAM(2) 18.02,26.46 14.59,22.78 14.59,22.52 | 11.89,19.85 IC1.9 13.4,19.86 14.43,20.89 14.43,22.52 | R5.2 R4.1 arc-90 14.09,17.23 v14.09,18.2 14.09,18.33 | v15.48,22.4 14.59,22.4 14.59,22.52 | 14.43,22.52 14.59,22.52 | 14.43,22.52 | 14.43,22.52 15.19,23.29 15.19,23.42
  Bottom 0.305: v15.48,22.4 15.48,19.6 v14.09,18.2
DSDAP1  (via drill 0.35)
  Top 0.254: 12.57,20.36 IC1.8
  Top 0.305: R6.2 R5.1 11.2,18.37 v11.29,18.46 | J2.DSDAP(1) 18.15,28.24 17.52,28.24 16.75,27.48 16.75,26.33 14.21,23.79 v14.09,23.79 14.09,23.66 13.84,23.42 13.84,20.96 13.25,20.36 12.57,20.36
  Bottom 0.305: v11.29,18.46 13.32,20.49 13.32,23.03 v14.09,23.79
GND  (via drill 0.35)
  Top 0.305: X1.4 22.99,9.52 | 15.95,18.34 R4.2 | 15.95,18.34 15.24,19.05 15.24,21.34 15.27,21.36 IC1.5 16.79,21.36 17.65,22.23 | 15.95,18.34 16.07,18.46 v16.63,18.46 | v11.8,22.27 11.8,23.45 R8.1 11.89,24.39 v12.31,24.81 12.31,24.94 13.16,25.78 13.38,25.78 14,26.4 14,26.86 15.05,27.9 15.27,27.9 J2.GND(3)
  Top 0.559: D1.C 46.93,8.56 v47.88,8.56
  Bottom 0.508: 11.3,6.98 9.79,8.5 9.79,9.63 8.64,10.79 v8.64,11.43
  other vias: 48.39,33.66 48.39,32.38 48.39,31.12 48.39,29.85 48.39,28.57 48.39,27.3 47.12,27.3 47.12,28.57 47.12,29.85 47.12,31.12 47.12,32.38 47.12,33.66 68.71,33.66 68.71,32.38 68.71,31.12 68.71,29.85 68.71,28.57 68.71,27.3 69.98,27.3 69.98,28.57 69.98,29.85 69.98,31.12 69.98,32.38 69.98,33.66 55.75,6.27 44.58,6.53 36.7,11.3 27.56,14.1 32.64,21.21 32.64,21.97 31.88,21.97 31.88,21.21 32.64,22.73 31.88,22.73 38.99,11.3 31.88,38.74 31.88,37.97 31.11,38.74 31.11,37.97 31.88,39.5 31.11,39.5 36.7,37.97 37.46,37.97 36.7,38.74 36.7,39.5 37.46,38.74 37.46,39.5 33.91,34.16 40,35.43 34.92,34.16 33.4,30.86 19.18,16.38 21.84,10.54 12.57,18.41 25.27,40.01 43.05,40.01 43.05,22.23 21.34,30.61 22.73,4.45 43.05,4.45 22.86,20.45 24,15.88 25.02,22.23 25.27,32.38 6.22,18.41 13.84,34.93 8.76,28.19 3.68,40.01 76.07,3.18
  pour Top (isolate 0.305, rank 2): 41.27,2.54 41.27,41.66 73.02,41.66 73.02,2.54
  pour Bottom (isolate 0.406, rank 2): 41.27,41.78 78.61,41.78 78.61,0.64 41.27,0.64
  pour Top (isolate 0.305, rank 2): 44.83,28.57 44.83,2.16 5.33,2.16 5.33,28.57
  pour Bottom (isolate 0.406, rank 2): 5.46,28.57 5.46,1.27 43.56,1.27 43.56,28.57
  pour Top (isolate 0.406, rank 3): 5.33,41.78 5.33,27.81 41.78,27.81 41.78,41.78
  pour Bottom (isolate 0.406): 5.46,41.78 41.78,41.78 41.78,27.94 5.46,27.94
  pour Top: 1.14,9.52 1.14,43.82 69.72,43.82 69.72,41.27 7.49,41.27 6.22,40.01 6.22,9.52
  pour Bottom: 1.14,10.16 1.14,43.82 69.6,43.82 69.6,41.27 6.22,41.27 6.22,10.16
  pour Top: 72.26,34.54 79.25,34.54 79.25,0.13 10.03,0.13 10.03,3.18 72.26,3.18
N$1
  Top 0.559: D1.A 46.89,6.97 R1.1
N$3
  Top 0.559: R2.1 36.94,12.85 D4.A
N$4
  Top 0.305: D3.A 37.71,36.17 30.96,36.17 28.88,38.24 R3.1
SCL
  Top 0.305: X1.2 13.84,10.8 15.24,12.19 18.91,12.19 22.47,15.75 22.47,18.42 R11.1 20.02,20.86 IC1.4
SDA  (via drill 0.35)
  Top 0.305: IC1.2 18.74,19.86 R10.1 19.33,19.56 v20.18,18.71 | X1.1 11.3,10.46 17.15,16.3 v17.64,16.3
  Bottom 0.305: v20.18,18.71 20.06,18.71 v17.64,16.3

### Text on the board
tPlace: 5-to-3V3@400mA Lin Reg | GND | EDGE | 3.3V | GND | 5V | GND | 3.3V | GND | 5V | GND | GND | I2C Display | V1.0 | 24V | GND | 24V | 24V | Barrel Jack Connector w/24V Conditioning + Fuse + LED